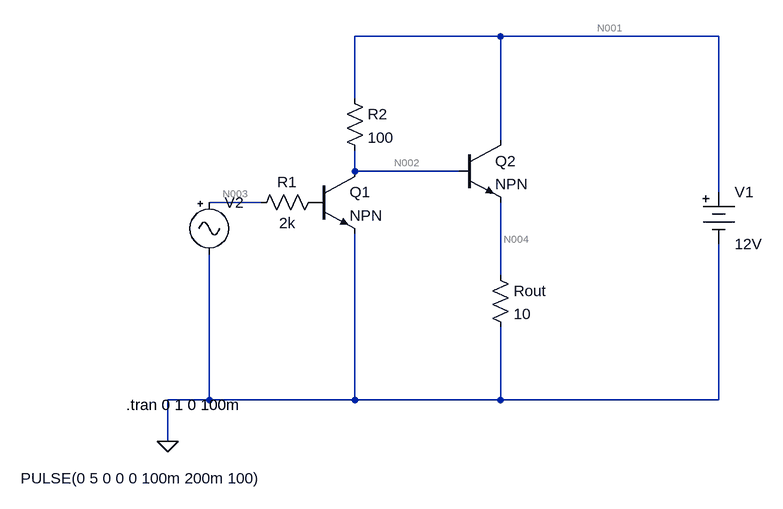
[diagram p0: schematic NPN NOT gate.asc]
NPN NOT gate.asc, the LTspice schematic file:
Version 4
SHEET 1 3624 680
WIRE 624 -192 400 -192
WIRE 960 -192 624 -192
WIRE 400 -96 400 -192
WIRE 624 -32 624 -192
WIRE 400 16 400 -16
WIRE 560 16 400 16
WIRE 960 48 960 -192
WIRE 256 64 176 64
WIRE 624 176 624 64
WIRE 176 368 176 144
WIRE 176 368 112 368
WIRE 400 368 400 112
WIRE 400 368 176 368
WIRE 624 368 624 256
WIRE 624 368 400 368
WIRE 960 368 960 128
WIRE 960 368 624 368
WIRE 112 432 112 368
FLAG 112 432 0
SYMBOL Misc\\battery 960 32 R0
WINDOW 123 0 0 Left 0
WINDOW 39 0 0 Left 0
SYMATTR InstName V1
SYMATTR Value 12V
SYMBOL res 608 160 R0
SYMATTR InstName Rout
SYMATTR Value 10
SYMBOL Misc\\signal 176 48 R0
WINDOW 123 0 0 Left 0
WINDOW 39 0 0 Left 0
WINDOW 3 -290 441 Left 2
SYMATTR Value PULSE(0 5 0 0 0 100m 200m 100)
SYMATTR InstName V2
SYMBOL npn 336 16 R0
SYMATTR InstName Q1
SYMBOL res 240 80 R270
WINDOW 0 32 56 VTop 2
WINDOW 3 0 56 VBottom 2
SYMATTR InstName R1
SYMATTR Value 2k
SYMBOL npn 560 -32 R0
SYMATTR InstName Q2
SYMBOL res 384 -112 R0
SYMATTR InstName R2
SYMATTR Value 100
TEXT 48 376 Left 2 !.tran 0 1 0 100m

The netlist it stands for:
* NPN NOT gate.asc
V1 N001 0 12V
Rout N004 0 10
V2 N003 0 PULSE(0 5 0 0 0 100m 200m 100)
Q1 N002 P001 0 0 NPN
R1 N003 P001 2k
Q2 N001 N002 N004 0 NPN
R2 N001 N002 100
.model NPN NPN
.model PNP PNP
.lib standard.bjt
.tran 0 1 0 100m
.backanno
.end

* Results of the author's LTspice run, read from the files saved beside the schematic
* Operating Point, zero values left out:
*   V(n001) = 12 V
*   V(n004) = 10.05 V
*   V(n002) = 11 V
*   V(p001) = 22.01 nV
*   Ic(Q2) = 995.3 mA
*   Ib(Q2) = 9.953 mA
*   Ie(Q2) = -1.005 A
*   Ic(Q1) = 11 pA
*   Ib(Q1) = -11 pA
*   I(R2) = 9.952 mA
*   I(R1) = -11 pA
*   I(Rout) = 1.005 A
*   I(V2) = 11 pA
*   I(V1) = -1.005 A
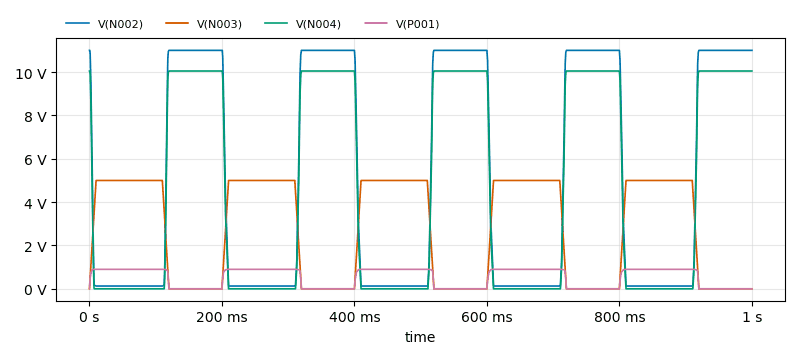
[diagram p1: Transient Analysis of NPN NOT gate.asc, plotted from the saved traces]
* Transient Analysis, 1 run:
*   V(N002): min 128.2 mV, max 11 V, average 4.971 V, rms 7.256 V, last 11 V
*   V(N003): min 0 V, max 5 V, average 2.75 V, rms 3.655 V, last 0 V
*   V(N004): min 0 V, max 10.05 V, average 4.461 V, rms 6.616 V, last 10.05 V
*   V(P001): min 0 V, max 898.3 mV, average 526.4 mV, rms 684.2 mV, last 0 V